# Altium schematic sheet array.SchDoc: CS - Array
size Letter; CheckedBy: J. Brinton; CompanyName: Signal Laboratories, Inc.; DrawnBy: J. Brinton; Engineer: J. Brinton; Address1: 3479 Edison Way; Address2: Menlo Park CA 94025; Address3: +1 (877) 778-8435; Address4: siglabs.com; Revision: 3; SheetNumber: 3; SheetTotal: 47
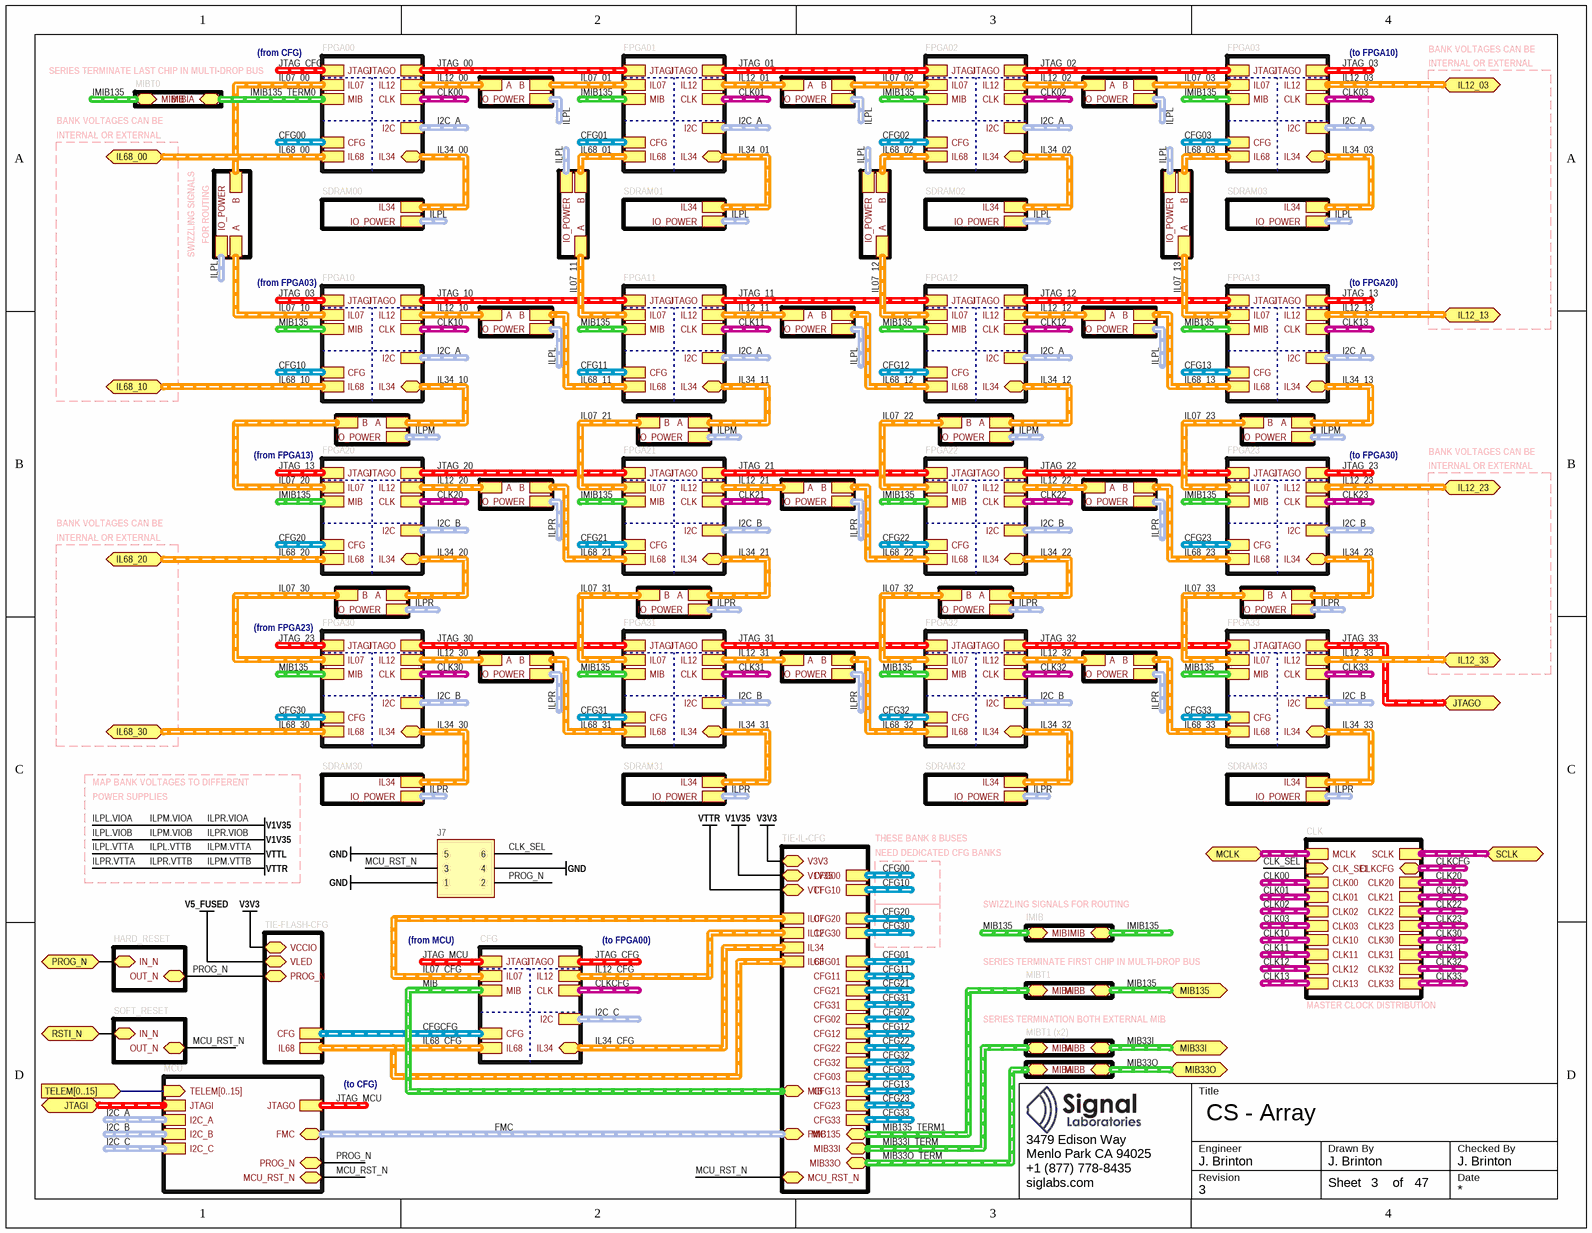
[diagram p0: array.SchDoc]

## Parts
J7  GRPB032MWCN-RC  [GRPB032MWCN]  (value not drawn)

## Sub-sheets
CFG = fpga.SchDoc: MIB (harness MIB), CFG (harness CFG), JTAGI (harness JTAG-3V3), JTAGO (harness JTAG-3V3), IL07 (harness IL), IL68 (harness IL), IL12 (harness IL), CLK (harness LVPECL33), IL34 (harness IL), I2C (harness I2C-3V3)
CLK = clock.SchDoc: MCLK (harness LVPECL33), SCLK (harness LVPECL33), CLK00 (harness LVPECL33), CLK01 (harness LVPECL33), CLK02 (harness LVPECL33), CLK03 (harness LVPECL33), CLK10 (harness LVPECL33), CLK11 (harness LVPECL33), CLK12 (harness LVPECL33), CLK13 (harness LVPECL33), CLK20 (harness LVPECL33), CLK21 (harness LVPECL33), CLK22 (harness LVPECL33), CLK23 (harness LVPECL33), CLK30 (harness LVPECL33), CLK31 (harness LVPECL33), CLK32 (harness LVPECL33), CLK33 (harness LVPECL33), CLKCFG (harness LVPECL33), CLK_SEL (in)
FPGA00 = fpga.SchDoc: MIB (harness MIB), CFG (harness CFG), JTAGI (harness JTAG-3V3), JTAGO (harness JTAG-3V3), IL07 (harness IL), IL68 (harness IL), IL12 (harness IL), CLK (harness LVPECL33), IL34 (harness IL), I2C (harness I2C-3V3)
FPGA01 = fpga.SchDoc: MIB (harness MIB), CFG (harness CFG), JTAGI (harness JTAG-3V3), JTAGO (harness JTAG-3V3), IL07 (harness IL), IL68 (harness IL), IL12 (harness IL), CLK (harness LVPECL33), IL34 (harness IL), I2C (harness I2C-3V3)
FPGA02 = fpga.SchDoc: MIB (harness MIB), CFG (harness CFG), JTAGI (harness JTAG-3V3), JTAGO (harness JTAG-3V3), IL07 (harness IL), IL68 (harness IL), IL12 (harness IL), CLK (harness LVPECL33), IL34 (harness IL), I2C (harness I2C-3V3)
FPGA03 = fpga.SchDoc: MIB (harness MIB), CFG (harness CFG), JTAGI (harness JTAG-3V3), JTAGO (harness JTAG-3V3), IL07 (harness IL), IL68 (harness IL), IL12 (harness IL), CLK (harness LVPECL33), IL34 (harness IL), I2C (harness I2C-3V3)
FPGA10 = fpga.SchDoc: MIB (harness MIB), CFG (harness CFG), JTAGI (harness JTAG-3V3), JTAGO (harness JTAG-3V3), IL07 (harness IL), IL68 (harness IL), IL12 (harness IL), CLK (harness LVPECL33), IL34 (harness IL), I2C (harness I2C-3V3)
FPGA11 = fpga.SchDoc: MIB (harness MIB), CFG (harness CFG), JTAGI (harness JTAG-3V3), JTAGO (harness JTAG-3V3), IL07 (harness IL), IL68 (harness IL), IL12 (harness IL), CLK (harness LVPECL33), IL34 (harness IL), I2C (harness I2C-3V3)
FPGA12 = fpga.SchDoc: MIB (harness MIB), CFG (harness CFG), JTAGI (harness JTAG-3V3), JTAGO (harness JTAG-3V3), IL07 (harness IL), IL68 (harness IL), IL12 (harness IL), CLK (harness LVPECL33), IL34 (harness IL), I2C (harness I2C-3V3)
FPGA13 = fpga.SchDoc: MIB (harness MIB), CFG (harness CFG), JTAGI (harness JTAG-3V3), JTAGO (harness JTAG-3V3), IL07 (harness IL), IL68 (harness IL), IL12 (harness IL), CLK (harness LVPECL33), IL34 (harness IL), I2C (harness I2C-3V3)
FPGA20 = fpga.SchDoc: MIB (harness MIB), CFG (harness CFG), JTAGI (harness JTAG-3V3), JTAGO (harness JTAG-3V3), IL07 (harness IL), IL68 (harness IL), IL12 (harness IL), CLK (harness LVPECL33), IL34 (harness IL), I2C (harness I2C-3V3)
FPGA21 = fpga.SchDoc: MIB (harness MIB), CFG (harness CFG), JTAGI (harness JTAG-3V3), JTAGO (harness JTAG-3V3), IL07 (harness IL), IL68 (harness IL), IL12 (harness IL), CLK (harness LVPECL33), IL34 (harness IL), I2C (harness I2C-3V3)
FPGA22 = fpga.SchDoc: MIB (harness MIB), CFG (harness CFG), JTAGI (harness JTAG-3V3), JTAGO (harness JTAG-3V3), IL07 (harness IL), IL68 (harness IL), IL12 (harness IL), CLK (harness LVPECL33), IL34 (harness IL), I2C (harness I2C-3V3)
FPGA23 = fpga.SchDoc: MIB (harness MIB), CFG (harness CFG), JTAGI (harness JTAG-3V3), JTAGO (harness JTAG-3V3), IL07 (harness IL), IL68 (harness IL), IL12 (harness IL), CLK (harness LVPECL33), IL34 (harness IL), I2C (harness I2C-3V3)
FPGA30 = fpga.SchDoc: MIB (harness MIB), CFG (harness CFG), JTAGI (harness JTAG-3V3), JTAGO (harness JTAG-3V3), IL07 (harness IL), IL68 (harness IL), IL12 (harness IL), CLK (harness LVPECL33), IL34 (harness IL), I2C (harness I2C-3V3)
FPGA31 = fpga.SchDoc: MIB (harness MIB), CFG (harness CFG), JTAGI (harness JTAG-3V3), JTAGO (harness JTAG-3V3), IL07 (harness IL), IL68 (harness IL), IL12 (harness IL), CLK (harness LVPECL33), IL34 (harness IL), I2C (harness I2C-3V3)
FPGA32 = fpga.SchDoc: MIB (harness MIB), CFG (harness CFG), JTAGI (harness JTAG-3V3), JTAGO (harness JTAG-3V3), IL07 (harness IL), IL68 (harness IL), IL12 (harness IL), CLK (harness LVPECL33), IL34 (harness IL), I2C (harness I2C-3V3)
FPGA33 = fpga.SchDoc: MIB (harness MIB), CFG (harness CFG), JTAGI (harness JTAG-3V3), JTAGO (harness JTAG-3V3), IL07 (harness IL), IL68 (harness IL), IL12 (harness IL), CLK (harness LVPECL33), IL34 (harness IL), I2C (harness I2C-3V3)
HARD_RESET = reset.SchDoc: OUT_N (bidir), IN_N (bidir)
IMIB = tie-mib-imib.SchDoc: MIB (harness MIB), IMIB (harness MIB)
MCU = MCU.SchDoc: JTAGI (harness JTAG-3V3), JTAGO (harness JTAG-3V3), I2C_A (harness I2C-3V3), I2C_B (harness I2C-3V3), I2C_C (harness I2C-3V3), TELEM[0..15] (in), FMC (harness FMC-3V3), PROG_N (bidir), MCU_RST_N (bidir)
MIBIT1 = tie-mib-term1.SchDoc: MIBB (harness MIB), MIBA (harness MIB)
MIBOT1 = tie-mib-term1.SchDoc: MIBB (harness MIB), MIBA (harness MIB)
MIBT0 = tie-mib-term0.SchDoc: MIBIB (harness MIB), MIBIA (harness MIB)
MIBT1 = tie-mib-term1.SchDoc: MIBB (harness MIB), MIBA (harness MIB)
SDRAM00 = tie-il34-sdram.SchDoc: IL34 (harness IL), IO_POWER (harness ILP)
SDRAM01 = tie-il34-sdram.SchDoc: IL34 (harness IL), IO_POWER (harness ILP)
SDRAM02 = tie-il34-sdram.SchDoc: IL34 (harness IL), IO_POWER (harness ILP)
SDRAM03 = tie-il34-sdram.SchDoc: IL34 (harness IL), IO_POWER (harness ILP)
SDRAM30 = tie-il34-sdram.SchDoc: IL34 (harness IL), IO_POWER (harness ILP)
SDRAM31 = tie-il34-sdram.SchDoc: IL34 (harness IL), IO_POWER (harness ILP)
SDRAM32 = tie-il34-sdram.SchDoc: IL34 (harness IL), IO_POWER (harness ILP)
SDRAM33 = tie-il34-sdram.SchDoc: IL34 (harness IL), IO_POWER (harness ILP)
SOFT_RESET = reset.SchDoc: OUT_N (bidir), IN_N (bidir)
TIE-FLASH-CFG = tie-flash-cfg.SchDoc: CFG (harness CFG), PROG_N (bidir), VCCIO, IL68 (harness IL), VLED
TIE-IL07_00-IL07_10 = tie-il07-il07.SchDoc: B (harness IL), A (harness IL), IO_POWER (harness ILP)
TIE-IL12_00-IL07_01 = tie-il12-il07.SchDoc: A (harness IL), B (harness IL), IO_POWER (harness ILP)
TIE-IL12_01-IL07_02 = tie-il12-il07.SchDoc: A (harness IL), B (harness IL), IO_POWER (harness ILP)
TIE-IL12_02-IL07_03 = tie-il12-il07.SchDoc: A (harness IL), B (harness IL), IO_POWER (harness ILP)
TIE-IL12_10-IL68_11 = tie-il12-il68.SchDoc: A (harness IL), B (harness IL), IO_POWER (harness ILP)
TIE-IL12_11-IL68_12 = tie-il12-il68.SchDoc: A (harness IL), B (harness IL), IO_POWER (harness ILP)
TIE-IL12_12-IL68_13 = tie-il12-il68.SchDoc: A (harness IL), B (harness IL), IO_POWER (harness ILP)
TIE-IL12_20-IL68_21 = tie-il12-il68.SchDoc: A (harness IL), B (harness IL), IO_POWER (harness ILP)
TIE-IL12_21-IL68_22 = tie-il12-il68.SchDoc: A (harness IL), B (harness IL), IO_POWER (harness ILP)
TIE-IL12_22-IL68_23 = tie-il12-il68.SchDoc: A (harness IL), B (harness IL), IO_POWER (harness ILP)
TIE-IL12_30-IL68_31 = tie-il12-il68.SchDoc: A (harness IL), B (harness IL), IO_POWER (harness ILP)
TIE-IL12_31-IL68_32 = tie-il12-il68.SchDoc: A (harness IL), B (harness IL), IO_POWER (harness ILP)
TIE-IL12_32-IL68_33 = tie-il12-il68.SchDoc: A (harness IL), B (harness IL), IO_POWER (harness ILP)
TIE-IL34_10-IL07_20 = tie-il34-il07.SchDoc: B (harness IL), A (harness IL), IO_POWER (harness ILP)
TIE-IL34_11-IL07_21 = tie-il34-il07.SchDoc: B (harness IL), A (harness IL), IO_POWER (harness ILP)
TIE-IL34_12-IL07_22 = tie-il34-il07.SchDoc: B (harness IL), A (harness IL), IO_POWER (harness ILP)
TIE-IL34_13-IL07_23 = tie-il34-il07.SchDoc: B (harness IL), A (harness IL), IO_POWER (harness ILP)
TIE-IL34_20-IL07_30 = tie-il34-il07.SchDoc: B (harness IL), A (harness IL), IO_POWER (harness ILP)
TIE-IL34_21-IL07_31 = tie-il34-il07.SchDoc: B (harness IL), A (harness IL), IO_POWER (harness ILP)
TIE-IL34_22-IL07_32 = tie-il34-il07.SchDoc: B (harness IL), A (harness IL), IO_POWER (harness ILP)
TIE-IL34_23-IL07_33 = tie-il34-il07.SchDoc: B (harness IL), A (harness IL), IO_POWER (harness ILP)
TIE-IL68_00-IL07_01 = tie-il68-il07.SchDoc: B (harness IL), A (harness IL), IO_POWER (harness ILP)
TIE-IL68_00-IL07_01 = tie-il68-il07.SchDoc: B (harness IL), A (harness IL), IO_POWER (harness ILP)
TIE-IL68_00-IL07_01 = tie-il68-il07.SchDoc: B (harness IL), A (harness IL), IO_POWER (harness ILP)
TIE-IL-CFG = tie-il-cfg.SchDoc: CFG03 (harness CFG), CFG02 (harness CFG), CFG01 (harness CFG), CFG00 (harness CFG), MIB33O (harness MIB), CFG13 (harness CFG), CFG12 (harness CFG), CFG11 (harness CFG), CFG10 (harness CFG), CFG23 (harness CFG), CFG22 (harness CFG), CFG21 (harness CFG), CFG20 (harness CFG), CFG33 (harness CFG), CFG32 (harness CFG), CFG31 (harness CFG), CFG30 (harness CFG), IL12 (harness IL), IL34 (harness IL), IL07 (harness IL), MIB135 (harness MIB), IL68 (harness IL), FMC (harness FMC-3V3), MIB33I (harness MIB), MIB (harness MIB), MCU_RST_N (bidir), V3V3, V1V35, VTT

## Ports
IL12_03 (harness IL), IL12_13 (harness IL), IL12_23 (harness IL), IL12_33 (harness IL), IL68_00 (harness IL), IL68_10 (harness IL), IL68_20 (harness IL), IL68_30 (harness IL), JTAGI (harness JTAG-3V3), JTAGO (harness JTAG-3V3), MCLK (harness LVPECL33), MIB33I (harness MIB), MIB33O (harness MIB), MIB135 (harness MIB), PROG_N (bidir), RSTI_N (bidir), SCLK (harness LVPECL33), TELEM[0..15] (in)

## Nets
GND: J7.1 J7.4 J7.5
ILPL.VIOA: sheet TIE-IL-CFG/V1V35  [also labelled ILPL.VIOB, ILPM.VIOA, ILPM.VIOB, ILPR.VIOA, ILPR.VIOB, V1V35]
ILPM.VTTB: sheet TIE-IL-CFG/VTT  [also labelled ILPR.VTTA, ILPR.VTTB, VTTR]
V3V3: sheet TIE-IL-CFG/V3V3, sheet TIE-FLASH-CFG/VCCIO
V5_FUSED: sheet TIE-FLASH-CFG/VLED
CLK_SEL: J7.6 ; sheet CLK/CLK_SEL
MCU_RST_N: J7.3 ; sheet TIE-IL-CFG/MCU_RST_N, sheet SOFT_RESET/OUT_N, sheet MCU/MCU_RST_N
PROG_N: J7.2 ; sheet TIE-FLASH-CFG/PROG_N, sheet HARD_RESET/OUT_N, sheet MCU/PROG_N
PROG_N: port PROG_N, sheet HARD_RESET/IN_N  [a separate net that carries the same name]
RSTI_N: port RSTI_N, sheet SOFT_RESET/IN_N

## Buses and harness runs
bus port TELEM[0..15] = sheet MCU/TELEM[0..15]
harness CFG00 = sheet FPGA00/CFG
harness CFG00 = sheet TIE-IL-CFG/CFG00
harness CFG01 = sheet FPGA01/CFG
harness CFG01 = sheet TIE-IL-CFG/CFG01
harness CFG02 = sheet FPGA02/CFG
harness CFG02 = sheet TIE-IL-CFG/CFG02
harness CFG03 = sheet FPGA03/CFG
harness CFG03 = sheet TIE-IL-CFG/CFG03
harness CFG10 = sheet FPGA10/CFG
harness CFG10 = sheet TIE-IL-CFG/CFG10
harness CFG11 = sheet FPGA11/CFG
harness CFG11 = sheet TIE-IL-CFG/CFG11
harness CFG12 = sheet FPGA12/CFG
harness CFG12 = sheet TIE-IL-CFG/CFG12
harness CFG13 = sheet FPGA13/CFG
harness CFG13 = sheet TIE-IL-CFG/CFG13
harness CFG20 = sheet FPGA20/CFG
harness CFG20 = sheet TIE-IL-CFG/CFG20
harness CFG21 = sheet FPGA21/CFG
harness CFG21 = sheet TIE-IL-CFG/CFG21
harness CFG22 = sheet FPGA22/CFG
harness CFG22 = sheet TIE-IL-CFG/CFG22
harness CFG23 = sheet FPGA23/CFG
harness CFG23 = sheet TIE-IL-CFG/CFG23
harness CFG30 = sheet FPGA30/CFG
harness CFG30 = sheet TIE-IL-CFG/CFG30
harness CFG31 = sheet FPGA31/CFG
harness CFG31 = sheet TIE-IL-CFG/CFG31
harness CFG32 = sheet FPGA32/CFG
harness CFG32 = sheet TIE-IL-CFG/CFG32
harness CFG33 = sheet FPGA33/CFG
harness CFG33 = sheet TIE-IL-CFG/CFG33
harness CFGCFG = sheet CFG/CFG = sheet TIE-FLASH-CFG/CFG
harness CLK00 = sheet CLK/CLK00
harness CLK00 = sheet FPGA00/CLK
harness CLK01 = sheet CLK/CLK01
harness CLK01 = sheet FPGA01/CLK
harness CLK02 = sheet CLK/CLK02
harness CLK02 = sheet FPGA02/CLK
harness CLK03 = sheet CLK/CLK03
harness CLK03 = sheet FPGA03/CLK
harness CLK10 = sheet CLK/CLK10
harness CLK10 = sheet FPGA10/CLK
harness CLK11 = sheet CLK/CLK11
harness CLK11 = sheet FPGA11/CLK
harness CLK12 = sheet CLK/CLK12
harness CLK12 = sheet FPGA12/CLK
harness CLK13 = sheet CLK/CLK13
harness CLK13 = sheet FPGA13/CLK
harness CLK20 = sheet CLK/CLK20
harness CLK20 = sheet FPGA20/CLK
harness CLK21 = sheet CLK/CLK21
harness CLK21 = sheet FPGA21/CLK
harness CLK22 = sheet CLK/CLK22
harness CLK22 = sheet FPGA22/CLK
harness CLK23 = sheet CLK/CLK23
harness CLK23 = sheet FPGA23/CLK
harness CLK30 = sheet CLK/CLK30
harness CLK30 = sheet FPGA30/CLK
harness CLK31 = sheet CLK/CLK31
harness CLK31 = sheet FPGA31/CLK
harness CLK32 = sheet CLK/CLK32
harness CLK32 = sheet FPGA32/CLK
harness CLK33 = sheet CLK/CLK33
harness CLK33 = sheet FPGA33/CLK
harness CLKCFG = sheet CFG/CLK
harness CLKCFG = sheet CLK/CLKCFG
harness FMC = sheet MCU/FMC = sheet TIE-IL-CFG/FMC
harness I2C_A = sheet FPGA00/I2C
harness I2C_A = sheet FPGA01/I2C
harness I2C_A = sheet FPGA02/I2C
harness I2C_A = sheet FPGA03/I2C
harness I2C_A = sheet FPGA10/I2C
harness I2C_A = sheet FPGA11/I2C
harness I2C_A = sheet FPGA12/I2C
harness I2C_A = sheet FPGA13/I2C
harness I2C_A = sheet MCU/I2C_A
harness I2C_B = sheet FPGA20/I2C
harness I2C_B = sheet FPGA21/I2C
harness I2C_B = sheet FPGA22/I2C
harness I2C_B = sheet FPGA23/I2C
harness I2C_B = sheet FPGA30/I2C
harness I2C_B = sheet FPGA31/I2C
harness I2C_B = sheet FPGA32/I2C
harness I2C_B = sheet FPGA33/I2C
harness I2C_B = sheet MCU/I2C_B
harness I2C_C = sheet CFG/I2C
harness I2C_C = sheet MCU/I2C_C
harness IL07_00 = sheet FPGA00/IL07 = sheet TIE-IL07_00-IL07_10/B
harness IL07_01 = sheet FPGA01/IL07 = sheet TIE-IL12_00-IL07_01/B
harness IL07_02 = sheet FPGA02/IL07 = sheet TIE-IL12_01-IL07_02/B
harness IL07_03 = sheet FPGA03/IL07 = sheet TIE-IL12_02-IL07_03/B
harness IL07_10 = sheet FPGA10/IL07 = sheet TIE-IL07_00-IL07_10/A
harness IL07_11 = sheet FPGA11/IL07 = sheet TIE-IL68_00-IL07_01/A
harness IL07_12 = sheet FPGA12/IL07 = sheet TIE-IL68_00-IL07_01/A
harness IL07_13 = sheet FPGA13/IL07 = sheet TIE-IL68_00-IL07_01/A
harness IL07_20 = sheet FPGA20/IL07 = sheet TIE-IL34_10-IL07_20/B
harness IL07_21 = sheet FPGA21/IL07 = sheet TIE-IL34_11-IL07_21/B
harness IL07_22 = sheet FPGA22/IL07 = sheet TIE-IL34_12-IL07_22/B
harness IL07_23 = sheet FPGA23/IL07 = sheet TIE-IL34_13-IL07_23/B
harness IL07_30 = sheet FPGA30/IL07 = sheet TIE-IL34_20-IL07_30/B
harness IL07_31 = sheet FPGA31/IL07 = sheet TIE-IL34_21-IL07_31/B
harness IL07_32 = sheet FPGA32/IL07 = sheet TIE-IL34_22-IL07_32/B
harness IL07_33 = sheet FPGA33/IL07 = sheet TIE-IL34_23-IL07_33/B
harness IL07_CFG = sheet CFG/IL07 = sheet TIE-IL-CFG/IL07
harness IL12_00 = sheet FPGA00/IL12 = sheet TIE-IL12_00-IL07_01/A
harness IL12_01 = sheet FPGA01/IL12 = sheet TIE-IL12_01-IL07_02/A
harness IL12_02 = sheet FPGA02/IL12 = sheet TIE-IL12_02-IL07_03/A
harness IL12_03 = port IL12_03 = sheet FPGA03/IL12
harness IL12_10 = sheet FPGA10/IL12 = sheet TIE-IL12_10-IL68_11/A
harness IL12_11 = sheet FPGA11/IL12 = sheet TIE-IL12_11-IL68_12/A
harness IL12_12 = sheet FPGA12/IL12 = sheet TIE-IL12_12-IL68_13/A
harness IL12_13 = port IL12_13 = sheet FPGA13/IL12
harness IL12_20 = sheet FPGA20/IL12 = sheet TIE-IL12_20-IL68_21/A
harness IL12_21 = sheet FPGA21/IL12 = sheet TIE-IL12_21-IL68_22/A
harness IL12_22 = sheet FPGA22/IL12 = sheet TIE-IL12_22-IL68_23/A
harness IL12_23 = port IL12_23 = sheet FPGA23/IL12
harness IL12_30 = sheet FPGA30/IL12 = sheet TIE-IL12_30-IL68_31/A
harness IL12_31 = sheet FPGA31/IL12 = sheet TIE-IL12_31-IL68_32/A
harness IL12_32 = sheet FPGA32/IL12 = sheet TIE-IL12_32-IL68_33/A
harness IL12_33 = port IL12_33 = sheet FPGA33/IL12
harness IL12_CFG = sheet CFG/IL12 = sheet TIE-IL-CFG/IL12
harness IL34_00 = sheet FPGA00/IL34 = sheet SDRAM00/IL34
harness IL34_01 = sheet FPGA01/IL34 = sheet SDRAM01/IL34
harness IL34_02 = sheet FPGA02/IL34 = sheet SDRAM02/IL34
harness IL34_03 = sheet FPGA03/IL34 = sheet SDRAM03/IL34
harness IL34_10 = sheet FPGA10/IL34 = sheet TIE-IL34_10-IL07_20/A
harness IL34_11 = sheet FPGA11/IL34 = sheet TIE-IL34_11-IL07_21/A
harness IL34_12 = sheet FPGA12/IL34 = sheet TIE-IL34_12-IL07_22/A
harness IL34_13 = sheet FPGA13/IL34 = sheet TIE-IL34_13-IL07_23/A
harness IL34_20 = sheet FPGA20/IL34 = sheet TIE-IL34_20-IL07_30/A
harness IL34_21 = sheet FPGA21/IL34 = sheet TIE-IL34_21-IL07_31/A
harness IL34_22 = sheet FPGA22/IL34 = sheet TIE-IL34_22-IL07_32/A
harness IL34_23 = sheet FPGA23/IL34 = sheet TIE-IL34_23-IL07_33/A
harness IL34_30 = sheet FPGA30/IL34 = sheet SDRAM30/IL34
harness IL34_31 = sheet FPGA31/IL34 = sheet SDRAM31/IL34
harness IL34_32 = sheet FPGA32/IL34 = sheet SDRAM32/IL34
harness IL34_33 = sheet FPGA33/IL34 = sheet SDRAM33/IL34
harness IL34_CFG = sheet CFG/IL34 = sheet TIE-IL-CFG/IL34
harness IL68_00 = port IL68_00 = sheet FPGA00/IL68
harness IL68_01 = sheet FPGA01/IL68 = sheet TIE-IL68_00-IL07_01/B
harness IL68_02 = sheet FPGA02/IL68 = sheet TIE-IL68_00-IL07_01/B
harness IL68_03 = sheet FPGA03/IL68 = sheet TIE-IL68_00-IL07_01/B
harness IL68_10 = port IL68_10 = sheet FPGA10/IL68
harness IL68_11 = sheet FPGA11/IL68 = sheet TIE-IL12_10-IL68_11/B
harness IL68_12 = sheet FPGA12/IL68 = sheet TIE-IL12_11-IL68_12/B
harness IL68_13 = sheet FPGA13/IL68 = sheet TIE-IL12_12-IL68_13/B
harness IL68_20 = port IL68_20 = sheet FPGA20/IL68
harness IL68_21 = sheet FPGA21/IL68 = sheet TIE-IL12_20-IL68_21/B
harness IL68_22 = sheet FPGA22/IL68 = sheet TIE-IL12_21-IL68_22/B
harness IL68_23 = sheet FPGA23/IL68 = sheet TIE-IL12_22-IL68_23/B
harness IL68_30 = port IL68_30 = sheet FPGA30/IL68
harness IL68_31 = sheet FPGA31/IL68 = sheet TIE-IL12_30-IL68_31/B
harness IL68_32 = sheet FPGA32/IL68 = sheet TIE-IL12_31-IL68_32/B
harness IL68_33 = sheet FPGA33/IL68 = sheet TIE-IL12_32-IL68_33/B
harness IL68_CFG = sheet CFG/IL68 = sheet TIE-FLASH-CFG/IL68 = sheet TIE-IL-CFG/IL68
harness ILPL = sheet SDRAM00/IO_POWER
harness ILPL = sheet SDRAM01/IO_POWER
harness ILPL = sheet SDRAM02/IO_POWER
harness ILPL = sheet SDRAM03/IO_POWER
harness ILPL = sheet TIE-IL07_00-IL07_10/IO_POWER
harness ILPL = sheet TIE-IL12_00-IL07_01/IO_POWER
harness ILPL = sheet TIE-IL12_01-IL07_02/IO_POWER
harness ILPL = sheet TIE-IL12_02-IL07_03/IO_POWER
harness ILPL = sheet TIE-IL12_10-IL68_11/IO_POWER
harness ILPL = sheet TIE-IL12_11-IL68_12/IO_POWER
harness ILPL = sheet TIE-IL12_12-IL68_13/IO_POWER
harness ILPL = sheet TIE-IL68_00-IL07_01/IO_POWER
harness ILPM = sheet TIE-IL34_10-IL07_20/IO_POWER
harness ILPM = sheet TIE-IL34_11-IL07_21/IO_POWER
harness ILPM = sheet TIE-IL34_12-IL07_22/IO_POWER
harness ILPM = sheet TIE-IL34_13-IL07_23/IO_POWER
harness ILPR = sheet SDRAM30/IO_POWER
harness ILPR = sheet SDRAM31/IO_POWER
harness ILPR = sheet SDRAM32/IO_POWER
harness ILPR = sheet SDRAM33/IO_POWER
harness ILPR = sheet TIE-IL12_20-IL68_21/IO_POWER
harness ILPR = sheet TIE-IL12_21-IL68_22/IO_POWER
harness ILPR = sheet TIE-IL12_22-IL68_23/IO_POWER
harness ILPR = sheet TIE-IL12_30-IL68_31/IO_POWER
harness ILPR = sheet TIE-IL12_31-IL68_32/IO_POWER
harness ILPR = sheet TIE-IL12_32-IL68_33/IO_POWER
harness ILPR = sheet TIE-IL34_20-IL07_30/IO_POWER
harness ILPR = sheet TIE-IL34_21-IL07_31/IO_POWER
harness ILPR = sheet TIE-IL34_22-IL07_32/IO_POWER
harness ILPR = sheet TIE-IL34_23-IL07_33/IO_POWER
harness IMIB135 = sheet FPGA01/MIB
harness IMIB135 = sheet FPGA02/MIB
harness IMIB135 = sheet FPGA03/MIB
harness IMIB135 = sheet FPGA20/MIB
harness IMIB135 = sheet FPGA21/MIB
harness IMIB135 = sheet FPGA22/MIB
harness IMIB135 = sheet FPGA23/MIB
harness IMIB135 = sheet IMIB/IMIB
harness IMIB135 = sheet MIBT0/MIBIB
harness IMIB135_TERM0 = sheet FPGA00/MIB = sheet MIBT0/MIBIA
harness JTAG_00 = sheet FPGA00/JTAGO = sheet FPGA01/JTAGI
harness JTAG_01 = sheet FPGA01/JTAGO = sheet FPGA02/JTAGI
harness JTAG_02 = sheet FPGA02/JTAGO = sheet FPGA03/JTAGI
harness JTAG_03 = sheet FPGA03/JTAGO
harness JTAG_03 = sheet FPGA10/JTAGI
harness JTAG_10 = sheet FPGA10/JTAGO = sheet FPGA11/JTAGI
harness JTAG_11 = sheet FPGA11/JTAGO = sheet FPGA12/JTAGI
harness JTAG_12 = sheet FPGA12/JTAGO = sheet FPGA13/JTAGI
harness JTAG_13 = sheet FPGA13/JTAGO
harness JTAG_13 = sheet FPGA20/JTAGI
harness JTAG_20 = sheet FPGA20/JTAGO = sheet FPGA21/JTAGI
harness JTAG_21 = sheet FPGA21/JTAGO = sheet FPGA22/JTAGI
harness JTAG_22 = sheet FPGA22/JTAGO = sheet FPGA23/JTAGI
harness JTAG_23 = sheet FPGA23/JTAGO
harness JTAG_23 = sheet FPGA30/JTAGI
harness JTAG_30 = sheet FPGA30/JTAGO = sheet FPGA31/JTAGI
harness JTAG_31 = sheet FPGA31/JTAGO = sheet FPGA32/JTAGI
harness JTAG_32 = sheet FPGA32/JTAGO = sheet FPGA33/JTAGI
harness JTAG_33 = port JTAGO = sheet FPGA33/JTAGO
harness JTAG_CFG = sheet CFG/JTAGO
harness JTAG_CFG = sheet FPGA00/JTAGI
harness JTAG_MCU = sheet CFG/JTAGI
harness JTAG_MCU = sheet MCU/JTAGO
harness MIB33I = port MIB33I = sheet MIBIT1/MIBB
harness MIB33I_TERM = sheet MIBIT1/MIBA = sheet TIE-IL-CFG/MIB33I
harness MIB33O = port MIB33O = sheet MIBOT1/MIBB
harness MIB33O_TERM = sheet MIBOT1/MIBA = sheet TIE-IL-CFG/MIB33O
harness MIB135 = port MIB135 = sheet MIBT1/MIBB
harness MIB135 = sheet FPGA10/MIB
harness MIB135 = sheet FPGA11/MIB
harness MIB135 = sheet FPGA12/MIB
harness MIB135 = sheet FPGA13/MIB
harness MIB135 = sheet FPGA30/MIB
harness MIB135 = sheet FPGA31/MIB
harness MIB135 = sheet FPGA32/MIB
harness MIB135 = sheet FPGA33/MIB
harness MIB135 = sheet IMIB/MIB
harness MIB135_TERM1 = sheet MIBT1/MIBA = sheet TIE-IL-CFG/MIB135
harness MIB = sheet CFG/MIB = sheet TIE-IL-CFG/MIB
harness port JTAGI = sheet MCU/JTAGI
harness port MCLK = sheet CLK/MCLK
harness port SCLK = sheet CLK/SCLK

## Notes on the sheet
- SERIES TERMINATE LAST CHIP IN MULTI-DROP BUS
- (from CFG)
- (to FPGA10)
- BANK VOLTAGES CAN BE
- INTERNAL OR EXTERNAL
- SWIZZLING SIGNALS
- FOR ROUTING
- (from FPGA03)
- (to FPGA20)
- (from FPGA13)
- (to FPGA30)
- (from FPGA23)
- POWER SUPPLIES
- MAP BANK VOLTAGES TO DIFFERENT
- THESE BANK 8 BUSES
- NEED DEDICATED CFG BANKS
- (near J7) (from MCU)
- (to FPGA00)
- SWIZZLING SIGNALS FOR ROUTING
- SERIES TERMINATE FIRST CHIP IN MULTI-DROP BUS
- SERIES TERMINATION BOTH EXTERNAL MIB
- MIBT1 (x2)
- MIBT1
- MASTER CLOCK DISTRIBUTION
- (to CFG)
- Title
- Engineer
- Revision
- Drawn By
- Checked By
- Date
- Sheet
- of

## Library data of the parts
J7 = GRPB032MWCN-RC: Male Header, 0.050" Pitch, Right Angle, 2x3 Position; Manufacturer: Sullins; Manufacturer P/N: GRPB032MWCN-RC